# Altium schematic sheet Sheet5.SchDoc
size A4
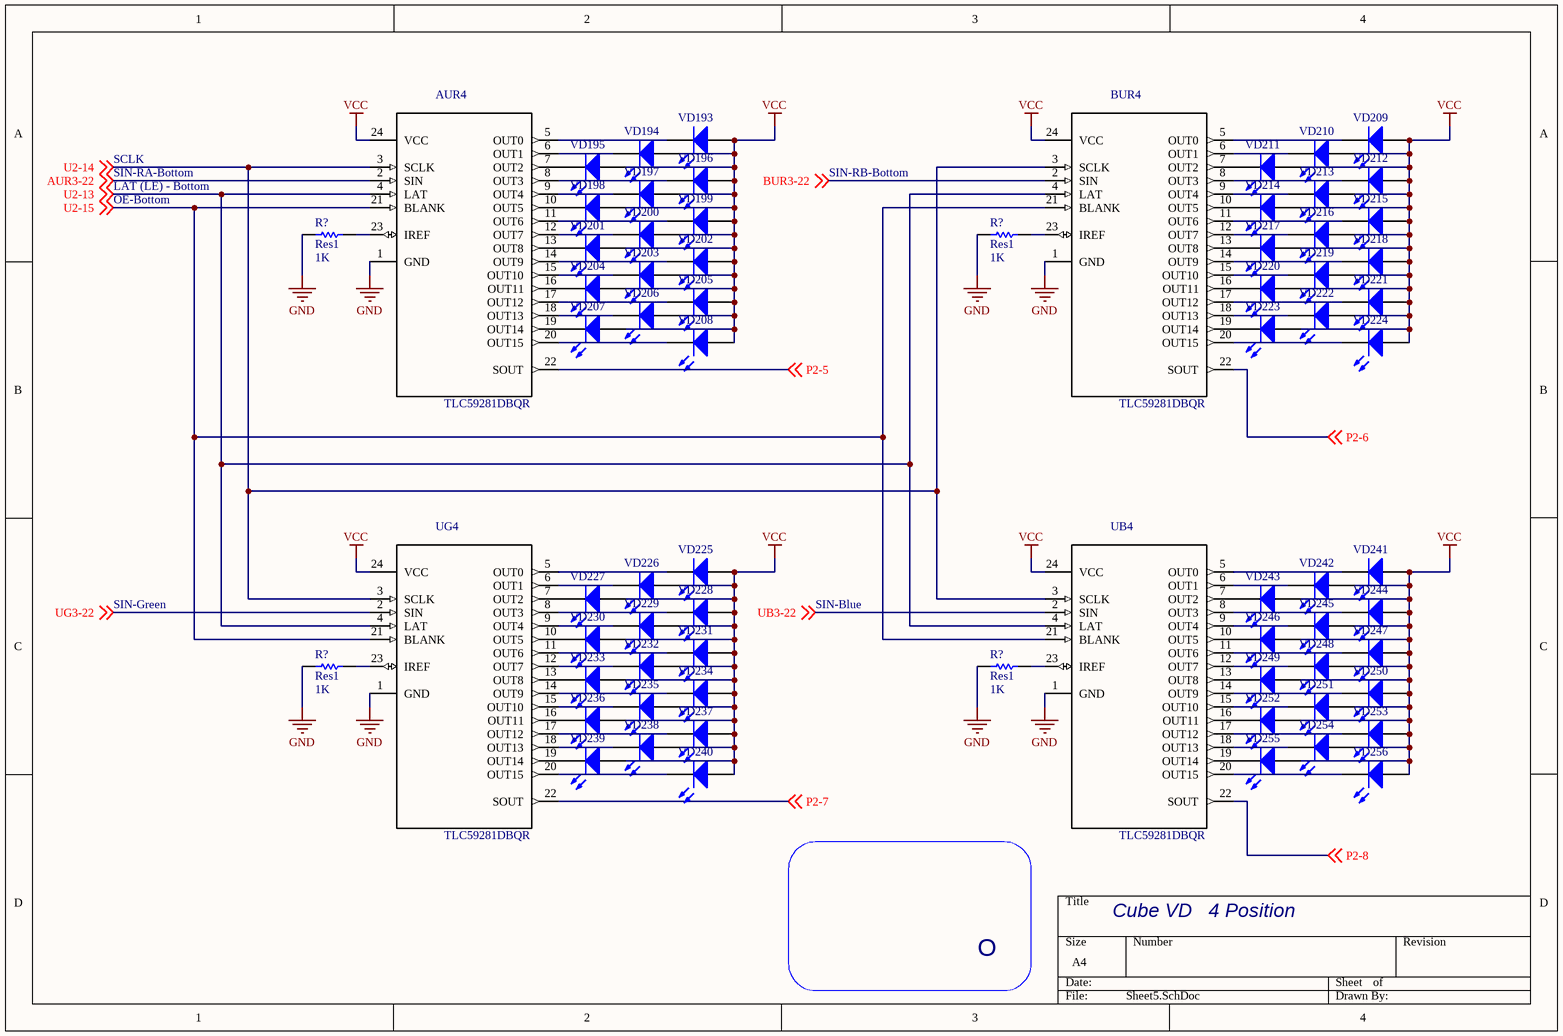
[diagram p0: Sheet5.SchDoc]

## Parts
(Parts that share a designator on the sheet are numbered #1, #2 ... from top to bottom, then left to right.)
AUR4  TLC59281DBQR  [SOP63P600X175-28N]
BUR4  TLC59281DBQR  [SOP63P600X175-28N]
R?#1  Res1  value 1K  [AXIAL-0.3]
R?#2  Res1  value 1K  [AXIAL-0.3]
R?#3  Res1  value 1K  [AXIAL-0.3]
R?#4  Res1  value 1K  [AXIAL-0.3]
UB4  TLC59281DBQR  [SOP63P600X175-28N]
UG4  TLC59281DBQR  [SOP63P600X175-28N]
VD193  LED  [LED-0]  (value not drawn)
VD194  LED  [LED-0]  (value not drawn)
VD195  LED  [LED-0]  (value not drawn)
VD196  LED  [LED-0]  (value not drawn)
VD197  LED  [LED-0]  (value not drawn)
VD198  LED  [LED-0]  (value not drawn)
VD199  LED  [LED-0]  (value not drawn)
VD200  (no value)  [LED-0]
VD201  LED  [LED-0]  (value not drawn)
VD202  (no value)  [LED-0]
VD203  LED  [LED-0]  (value not drawn)
VD204  LED  [LED-0]  (value not drawn)
VD205  LED  [LED-0]  (value not drawn)
VD206  LED  [LED-0]  (value not drawn)
VD207  LED  [LED-0]  (value not drawn)
VD208  LED  [LED-0]  (value not drawn)
VD209  LED  [LED-0]  (value not drawn)
VD210  LED  [LED-0]  (value not drawn)
VD211  LED  [LED-0]  (value not drawn)
VD212  LED  [LED-0]  (value not drawn)
VD213  LED  [LED-0]  (value not drawn)
VD214  LED  [LED-0]  (value not drawn)
VD215  LED  [LED-0]  (value not drawn)
VD216  LED  [LED-0]  (value not drawn)
VD217  LED  [LED-0]  (value not drawn)
VD218  LED  [LED-0]  (value not drawn)
VD219  LED  [LED-0]  (value not drawn)
VD220  LED  [LED-0]  (value not drawn)
VD221  LED  [LED-0]  (value not drawn)
VD222  LED  [LED-0]  (value not drawn)
VD223  LED  [LED-0]  (value not drawn)
VD224  LED  [LED-0]  (value not drawn)
VD225  LED  [LED-0]  (value not drawn)
VD226  LED  [LED-0]  (value not drawn)
VD227  LED  [LED-0]  (value not drawn)
VD228  LED  [LED-0]  (value not drawn)
VD229  LED  [LED-0]  (value not drawn)
VD230  LED  [LED-0]  (value not drawn)
VD231  LED  [LED-0]  (value not drawn)
VD232  LED  [LED-0]  (value not drawn)
VD233  LED  [LED-0]  (value not drawn)
VD234  LED  [LED-0]  (value not drawn)
VD235  LED  [LED-0]  (value not drawn)
VD236  LED  [LED-0]  (value not drawn)
VD237  LED  [LED-0]  (value not drawn)
VD238  LED  [LED-0]  (value not drawn)
VD239  LED  [LED-0]  (value not drawn)
VD240  LED  [LED-0]  (value not drawn)
VD241  LED  [LED-0]  (value not drawn)
VD242  LED  [LED-0]  (value not drawn)
VD243  LED  [LED-0]  (value not drawn)
VD244  LED  [LED-0]  (value not drawn)
VD245  LED  [LED-0]  (value not drawn)
VD246  LED  [LED-0]  (value not drawn)
VD247  LED  [LED-0]  (value not drawn)
VD248  LED  [LED-0]  (value not drawn)
VD249  LED  [LED-0]  (value not drawn)
VD250  LED  [LED-0]  (value not drawn)
VD251  LED  [LED-0]  (value not drawn)
VD252  LED  [LED-0]  (value not drawn)
VD253  LED  [LED-0]  (value not drawn)
VD254  LED  [LED-0]  (value not drawn)
VD255  LED  [LED-0]  (value not drawn)
VD256  LED  [LED-0]  (value not drawn)

## Nets
GND: AUR4.1(GND) BUR4.1(GND) R?#1.1 R?#2.1 R?#3.1 R?#4.1 UB4.1(GND) UG4.1(GND)
VCC: AUR4.24(VCC) BUR4.24(VCC) UB4.24(VCC) UG4.24(VCC) VD193.1(A) VD194.1(A) VD195.1(A) VD196.1(A) VD197.1(A) VD198.1(A) VD199.1(A) VD200.1(A) VD201.1(A) VD202.1(A) VD203.1(A) VD204.1(A) VD205.1(A) VD206.1(A) VD207.1(A) VD208.1(A) VD209.1(A) VD210.1(A) VD211.1(A) VD212.1(A) VD213.1(A) VD214.1(A) VD215.1(A) VD216.1(A) VD217.1(A) VD218.1(A) VD219.1(A) VD220.1(A) VD221.1(A) VD222.1(A) VD223.1(A) VD224.1(A) VD225.1(A) VD226.1(A) VD227.1(A) VD228.1(A) VD229.1(A) VD230.1(A) VD231.1(A) VD232.1(A) VD233.1(A) VD234.1(A) VD235.1(A) VD236.1(A) VD237.1(A) VD238.1(A) VD239.1(A) VD240.1(A) VD241.1(A) VD242.1(A) VD243.1(A) VD244.1(A) VD245.1(A) VD246.1(A) VD247.1(A) VD248.1(A) VD249.1(A) VD250.1(A) VD251.1(A) VD252.1(A) VD253.1(A) VD254.1(A) VD255.1(A) VD256.1(A)
AUR3-22: AUR4.2(SIN) ; off-sheet AUR3-22
BUR3-22: BUR4.2(SIN) ; off-sheet BUR3-22
P2-5: AUR4.22(SOUT) ; off-sheet P2-5
P2-6: BUR4.22(SOUT) ; off-sheet P2-6
P2-7: UG4.22(SOUT) ; off-sheet P2-7
P2-8: UB4.22(SOUT) ; off-sheet P2-8
U2-13: AUR4.4(LAT) BUR4.4(LAT) UB4.4(LAT) UG4.4(LAT) ; off-sheet U2-13
U2-14: AUR4.3(SCLK) BUR4.3(SCLK) UB4.3(SCLK) UG4.3(SCLK) ; off-sheet U2-14
U2-15: AUR4.21(BLANK) BUR4.21(BLANK) UB4.21(BLANK) UG4.21(BLANK) ; off-sheet U2-15
UB3-22: UB4.2(SIN) ; off-sheet UB3-22
UG3-22: UG4.2(SIN) ; off-sheet UG3-22
NetAUR4_5: AUR4.5(OUT0) VD193.2(K)
NetAUR4_6: AUR4.6(OUT1) VD194.2(K)
NetAUR4_7: AUR4.7(OUT2) VD195.2(K)
NetAUR4_8: AUR4.8(OUT3) VD196.2(K)
NetAUR4_9: AUR4.9(OUT4) VD197.2(K)
NetAUR4_10: AUR4.10(OUT5) VD198.2(K)
NetAUR4_11: AUR4.11(OUT6) VD199.2(K)
NetAUR4_12: AUR4.12(OUT7) VD200.2(K)
NetAUR4_13: AUR4.13(OUT8) VD201.2(K)
NetAUR4_14: AUR4.14(OUT9) VD202.2(K)
NetAUR4_15: AUR4.15(OUT10) VD203.2(K)
NetAUR4_16: AUR4.16(OUT11) VD204.2(K)
NetAUR4_17: AUR4.17(OUT12) VD205.2(K)
NetAUR4_18: AUR4.18(OUT13) VD206.2(K)
NetAUR4_19: AUR4.19(OUT14) VD207.2(K)
NetAUR4_20: AUR4.20(OUT15) VD208.2(K)
NetAUR4_23: AUR4.23(IREF) R?#1.2
NetBUR4_5: BUR4.5(OUT0) VD209.2(K)
NetBUR4_6: BUR4.6(OUT1) VD210.2(K)
NetBUR4_7: BUR4.7(OUT2) VD211.2(K)
NetBUR4_8: BUR4.8(OUT3) VD212.2(K)
NetBUR4_9: BUR4.9(OUT4) VD213.2(K)
NetBUR4_10: BUR4.10(OUT5) VD214.2(K)
NetBUR4_11: BUR4.11(OUT6) VD215.2(K)
NetBUR4_12: BUR4.12(OUT7) VD216.2(K)
NetBUR4_13: BUR4.13(OUT8) VD217.2(K)
NetBUR4_14: BUR4.14(OUT9) VD218.2(K)
NetBUR4_15: BUR4.15(OUT10) VD219.2(K)
NetBUR4_16: BUR4.16(OUT11) VD220.2(K)
NetBUR4_17: BUR4.17(OUT12) VD221.2(K)
NetBUR4_18: BUR4.18(OUT13) VD222.2(K)
NetBUR4_19: BUR4.19(OUT14) VD223.2(K)
NetBUR4_20: BUR4.20(OUT15) VD224.2(K)
NetBUR4_23: BUR4.23(IREF) R?#2.2
NetR?#3_2: R?#3.2 UG4.23(IREF)
NetR?#4_2: R?#4.2 UB4.23(IREF)
NetUB4_5: UB4.5(OUT0) VD241.2(K)
NetUB4_6: UB4.6(OUT1) VD242.2(K)
NetUB4_7: UB4.7(OUT2) VD243.2(K)
NetUB4_8: UB4.8(OUT3) VD244.2(K)
NetUB4_9: UB4.9(OUT4) VD245.2(K)
NetUB4_10: UB4.10(OUT5) VD246.2(K)
NetUB4_11: UB4.11(OUT6) VD247.2(K)
NetUB4_12: UB4.12(OUT7) VD248.2(K)
NetUB4_13: UB4.13(OUT8) VD249.2(K)
NetUB4_14: UB4.14(OUT9) VD250.2(K)
NetUB4_15: UB4.15(OUT10) VD251.2(K)
NetUB4_16: UB4.16(OUT11) VD252.2(K)
NetUB4_17: UB4.17(OUT12) VD253.2(K)
NetUB4_18: UB4.18(OUT13) VD254.2(K)
NetUB4_19: UB4.19(OUT14) VD255.2(K)
NetUB4_20: UB4.20(OUT15) VD256.2(K)
NetUG4_5: UG4.5(OUT0) VD225.2(K)
NetUG4_6: UG4.6(OUT1) VD226.2(K)
NetUG4_7: UG4.7(OUT2) VD227.2(K)
NetUG4_8: UG4.8(OUT3) VD228.2(K)
NetUG4_9: UG4.9(OUT4) VD229.2(K)
NetUG4_10: UG4.10(OUT5) VD230.2(K)
NetUG4_11: UG4.11(OUT6) VD231.2(K)
NetUG4_12: UG4.12(OUT7) VD232.2(K)
NetUG4_13: UG4.13(OUT8) VD233.2(K)
NetUG4_14: UG4.14(OUT9) VD234.2(K)
NetUG4_15: UG4.15(OUT10) VD235.2(K)
NetUG4_16: UG4.16(OUT11) VD236.2(K)
NetUG4_17: UG4.17(OUT12) VD237.2(K)
NetUG4_18: UG4.18(OUT13) VD238.2(K)
NetUG4_19: UG4.19(OUT14) VD239.2(K)
NetUG4_20: UG4.20(OUT15) VD240.2(K)

## Notes on the sheet
- SCLK
- SIN-RA-Bottom
- SIN-RB-Bottom
- OE-Bottom
- LAT (LE) - Bottom
- SIN-Green
- SIN-Blue
- Cube VD   4 Position
- O

## Library data of the parts
AUR4 BUR4 UB4 UG4 = TLC59281DBQR: 16-Channel, Constant-Current LED Driver without LED Open Detection 24-SSOP -40 to 85; MF: Texas Instruments; Price: 0.74 USD; Availability: Good; SnapEDA_Link: https://www.snapeda.com/parts/TLC59281DBQR/Texas%20Instruments/view-part/?ref=snap; MP: TLC59281DBQR; Package: SSOP-24 Texas Instruments; Value: *
R?#1-R?#4 = Res1: Resistor; Published: 8-Jun-2000; LatestRevisionDate: 17-Jul-2002; LatestRevisionNote: Re-released for DXP Platform.; PackageReference: AXIAL-0.3; Publisher: Altium Limited; PackageDescription: Axial Device, Thru-Hole; 2 Leads; 0.3 in Pin Spacing
VD193-VD256 = LED0: Typical INFRARED GaAs LED; Published: 8-Jun-2000; LatestRevisionDate: 08-Jul-2005; LatestRevisionNote: Mech Layer 1 removed.; PackageReference: LED-0; Publisher: Altium Limited; PackageDescription: LED; 2 Leads